# Altium schematic sheet [03] - MICROCONTROLLER.SchDoc
size A3; Collaborator: Romy Bompart
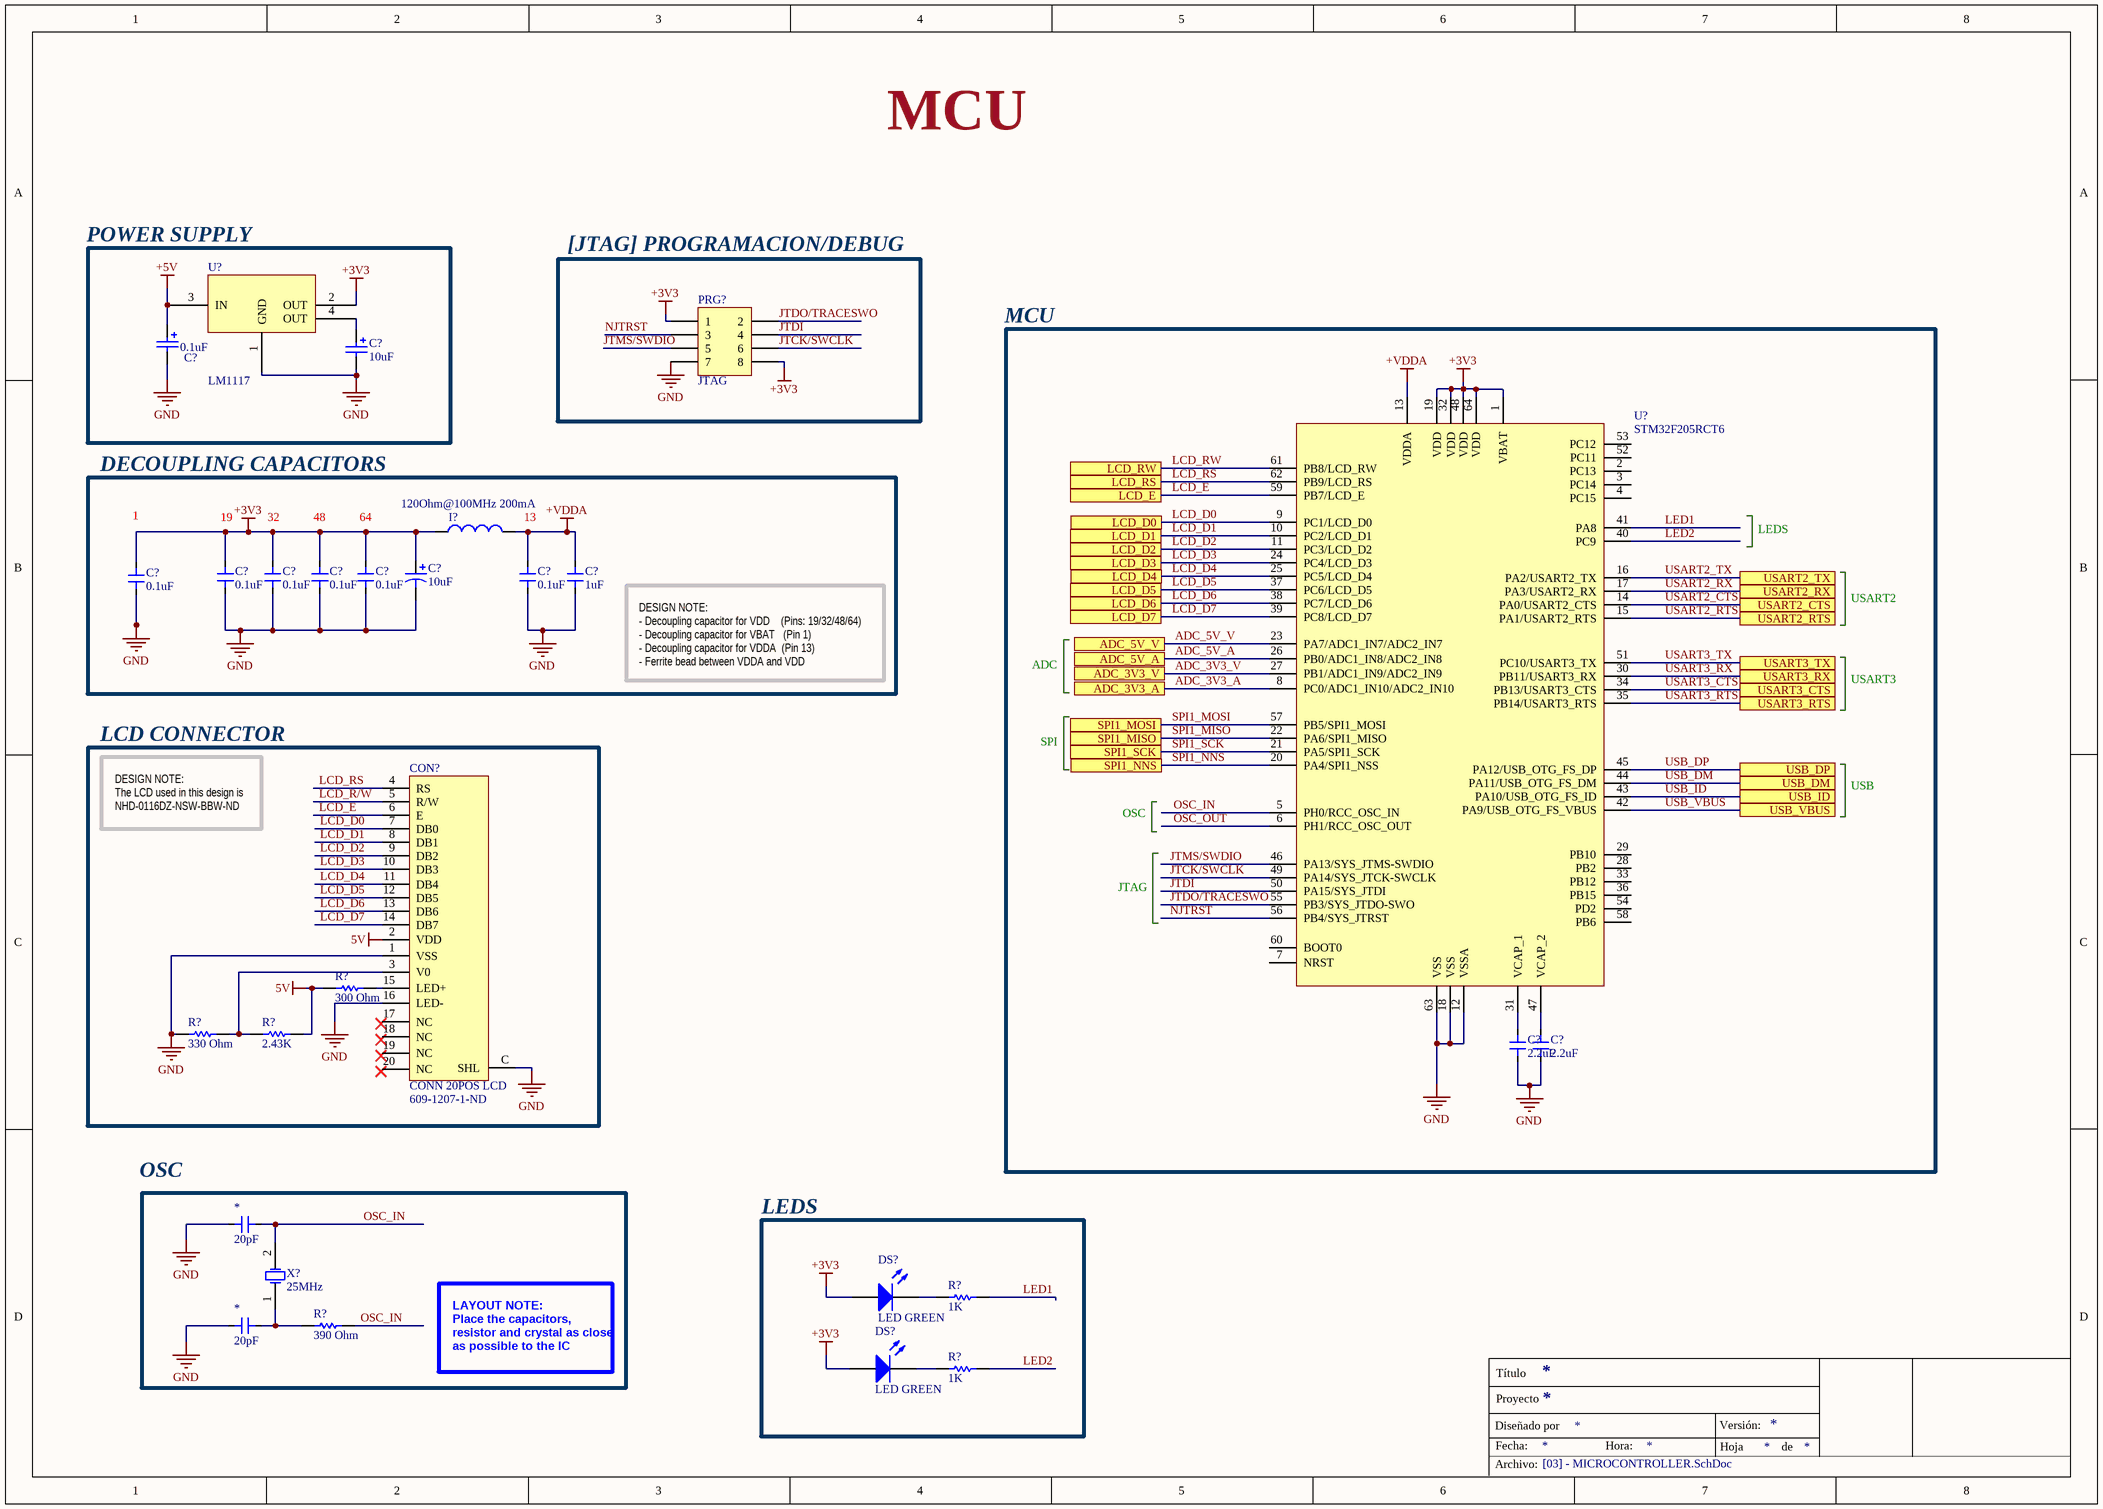
[diagram p0: [03] - MICROCONTROLLER.SchDoc]

## Parts
(Parts that share a designator on the sheet are numbered #1, #2 ... from top to bottom, then left to right.)
*#1  20pF  [CC-0603]
*#2  20pF  [CC-0603]
C?#1  value 0.1uF  [CC-0603]  (hidden comment: 1276-1000-1-ND)
C?#2  10uF  [CC-0805]
C?#3  10uF
C?#4  1uF
C?#5  0.1uF  [CC-0603]
C?#6  0.1uF  [CC-0603]
C?#7  0.1uF  [CC-0603]
C?#8  0.1uF  [CC-0603]
C?#9  0.1uF  [CC-0603]
C?#10  0.1uF  [CC-0603]
C?#11  2.2uF
C?#12  2.2uF
CON?  CONN 20POS LCD  Supplier Part Number 1: 609-1207-1-ND
DS?#1  LED GREEN
DS?#2  LED GREEN
I?  120Ohm@100MHz 200mA
PRG?  JTAG
R?#1  300 Ohm
R?#2  330 Ohm
R?#3  2.43K
R?#4  1K
R?#5  390 Ohm
R?#6  1K
U?#1  LM1117
U?#2  STM32F205RCT6
X?  25MHz

## Blocks framed on the sheet
POWER SUPPLY: C?#1 C?#2 U?#1
[JTAG] PROGRAMACION/DEBUG: PRG?
MCU: C?#11 C?#12 U?#2
DECOUPLING CAPACITORS: C?#3-C?#10 I?
LCD CONNECTOR: CON? R?#1-R?#3
OSC: *#1 *#2 R?#5 X?
LEDS: DS?#1 DS?#2 R?#4 R?#6

## Ports
ADC_3V3_A, ADC_3V3_V, ADC_5V_A, ADC_5V_V, LCD_D0, LCD_D1, LCD_D2, LCD_D3, LCD_D4, LCD_D5, LCD_D6, LCD_D7, LCD_E, LCD_RS, LCD_RW, SPI1_MISO, SPI1_MOSI, SPI1_NNS, SPI1_SCK, USART2_CTS, USART2_RTS, USART2_RX, USART2_TX, USART3_CTS, USART3_RTS, USART3_RX, USART3_TX, USB_DM, USB_DP, USB_ID, USB_VBUS

## Nets
5V: CON?.2(VDD) R?#1.1 R?#3.2
+3V3: C?#3.1 C?#5.1 C?#6.1 C?#7.1 C?#8.1 C?#9.1 DS?#1.2(A) DS?#2.2(A) I?.1 PRG?.1 PRG?.8 U?#1.2(OUT) U?#2.1(VBAT) U?#2.19(VDD) U?#2.32(VDD) U?#2.48(VDD) U?#2.64(VDD)
+5V: C?#1.1 U?#1.3(IN)
+VDDA: C?#4.2 C?#10.1 I?.2 U?#2.13(VDDA)
GND: *#1.2 *#2.2 C?#1.2 C?#2.2 C?#3.2 C?#4.1 C?#5.2 C?#6.2 C?#7.2 C?#8.2 C?#9.2 C?#10.2 C?#11.1 C?#12.2 CON?.1(VSS) CON?.16(LED-) CON?.C(SHL) PRG?.7 R?#2.1 U?#1.1(GND) U?#2.12(VSSA) U?#2.18(VSS) U?#2.63(VSS)
ADC_3V3_A: U?#2.8(PC0/ADC1_IN10/ADC2_IN10) ; port ADC_3V3_A
ADC_3V3_V: U?#2.27(PB1/ADC1_IN9/ADC2_IN9) ; port ADC_3V3_V
ADC_5V_A: U?#2.26(PB0/ADC1_IN8/ADC2_IN8) ; port ADC_5V_A
ADC_5V_V: U?#2.23(PA7/ADC1_IN7/ADC2_IN7) ; port ADC_5V_V
JTCK/SWCLK: PRG?.6 U?#2.49(PA14/SYS_JTCK-SWCLK)
JTDI: PRG?.4 U?#2.50(PA15/SYS_JTDI)
JTDO/TRACESWO: PRG?.2 U?#2.55(PB3/SYS_JTDO-SWO)
JTMS/SWDIO: PRG?.5 U?#2.46(PA13/SYS_JTMS-SWDIO)
LCD_D0: CON?.7(DB0) U?#2.9(PC1/LCD_D0) ; port LCD_D0
LCD_D1: CON?.8(DB1) U?#2.10(PC2/LCD_D1) ; port LCD_D1
LCD_D2: CON?.9(DB2) U?#2.11(PC3/LCD_D2) ; port LCD_D2
LCD_D3: CON?.10(DB3) U?#2.24(PC4/LCD_D3) ; port LCD_D3
LCD_D4: CON?.11(DB4) U?#2.25(PC5/LCD_D4) ; port LCD_D4
LCD_D5: CON?.12(DB5) U?#2.37(PC6/LCD_D5) ; port LCD_D5
LCD_D6: CON?.13(DB6) U?#2.38(PC7/LCD_D6) ; port LCD_D6
LCD_D7: CON?.14(DB7) U?#2.39(PC8/LCD_D7) ; port LCD_D7
LCD_E: CON?.6(E) U?#2.59(PB7/LCD_E) ; port LCD_E
LCD_R/W: CON?.5(R/W)
LCD_RS: CON?.4(RS) U?#2.62(PB9/LCD_RS) ; port LCD_RS
LCD_RW: U?#2.61(PB8/LCD_RW) ; port LCD_RW
LED1: R?#4.2 U?#2.41(PA8)
LED2: R?#6.2 U?#2.40(PC9)
NJTRST: PRG?.3 U?#2.56(PB4/SYS_JTRST)
OSC_IN: *#1.1 R?#5.2 U?#2.5(PH0/RCC_OSC_IN) X?.2(OSC2)
OSC_OUT: U?#2.6(PH1/RCC_OSC_OUT)
SPI1_MISO: U?#2.22(PA6/SPI1_MISO) ; port SPI1_MISO
SPI1_MOSI: U?#2.57(PB5/SPI1_MOSI) ; port SPI1_MOSI
SPI1_NNS: U?#2.20(PA4/SPI1_NSS) ; port SPI1_NNS
SPI1_SCK: U?#2.21(PA5/SPI1_SCK) ; port SPI1_SCK
USART2_CTS: U?#2.14(PA0/USART2_CTS) ; port USART2_CTS
USART2_RTS: U?#2.15(PA1/USART2_RTS) ; port USART2_RTS
USART2_RX: U?#2.17(PA3/USART2_RX) ; port USART2_RX
USART2_TX: U?#2.16(PA2/USART2_TX) ; port USART2_TX
USART3_CTS: U?#2.34(PB13/USART3_CTS) ; port USART3_CTS
USART3_RTS: U?#2.35(PB14/USART3_RTS) ; port USART3_RTS
USART3_RX: U?#2.30(PB11/USART3_RX) ; port USART3_RX
USART3_TX: U?#2.51(PC10/USART3_TX) ; port USART3_TX
USB_DM: U?#2.44(PA11/USB_OTG_FS_DM) ; port USB_DM
USB_DP: U?#2.45(PA12/USB_OTG_FS_DP) ; port USB_DP
USB_ID: U?#2.43(PA10/USB_OTG_FS_ID) ; port USB_ID
USB_VBUS: U?#2.42(PA9/USB_OTG_FS_VBUS) ; port USB_VBUS
Net*#2_1: *#2.1 R?#5.1 X?.1(OSC1)
NetC?#2_1: C?#2.1 U?#1.4(OUT)
NetC?#11_2: C?#11.2 U?#2.47(VCAP_2)
NetC?#12_1: C?#12.1 U?#2.31(VCAP_1)
NetCON?_3: CON?.3(V0) R?#2.2 R?#3.1
NetCON?_15: CON?.15(LED+) R?#1.2
NetDS?#1_1: DS?#1.1(K) R?#4.1
NetDS?#2_1: DS?#2.1(K) R?#6.1

Not connected (* = marked no-connect by the designer): CON? 17(NC) 18(NC) 19(NC) 20(NC); U?#2 2(PC13) 3(PC14) 4(PC15) 7(NRST) 28(PB2) 29(PB10) 33(PB12) 36(PB15) 52(PC11) 53(PC12) 54(PD2) 58(PB6) 60(BOOT0)

## Notes on the sheet
- MCU
- (near C?#5) 1
- (near C?#6) 19
- (near C?#7) 32
- (near C?#8) 48
- (near C?#9) 64
- (near I?) 13
- LEDS
- USART2
- DESIGN NOTE:
  - Decoupling capacitor for VDD    (Pins: 19/32/48/64)
  - Decoupling capacitor for VBAT   (Pin 1)
  - Decoupling capacitor for VDDA  (Pin 13)
  - Ferrite bead between VDDA and VDD
- ADC
- USART3
- SPI
- USB
- DESIGN NOTE:
  The LCD used in this design is NHD-0116DZ-NSW-BBW-ND
- OSC
- JTAG
- LAYOUT NOTE:
  Place the capacitors, resistor and crystal as close as possible to the IC
- Título
- Diseñado por
- Fecha:
- Proyecto
- Hora:
- Versión:
- Hoja
- de
- Archivo:

## Library data of the parts
*#1 *#2 = CC0603JRNPO9BN200: CAP CER 20PF 50V C0G/NPO 0603; Manufacturer: Yageo; Tolerance: 5%; Dielectric: C0G; Supplier 1: Digi-Key; Manufacturer Part Number: CC0603JRNPO9BN200; Stock 1: 223075; Pricing 1: 1=0.1, 10=0.048, 100=0.0214, 500=0.0153, 1000=0.012 (USD); Mount: Surface Mount; Case/Package: 0603; Number of Pins: 2; Weight: 7.1E-05oz; Case Code (Imperial): 0603; Case Code (Metric): 1608; Min Operating Temperature: -55°C; Max Operating Temperature: 125°C; Capacitance: 20pF; Package Quantity: 4000; Voltage Rating (DC): 50V; Packaging: Tape and Reel; Voltage Rating: 50V; Termination: SMD/SMT; Composition: Ceramic; Length: 1.6mm; Width: 0.8mm; Thickness: 0.035inch; Depth: 0.8mm; REACH SVHC: Unknown; Lead Free: Lead Free; ComponentLink1URL: http://www.farnell.com/datasheets/1132289.pdf?src-supplier=Element14; ComponentLink1Description: http://www.farnell.com/datasheets/1132289.pdf?src-supplier=Element14; ComponentLink2URL: http://www.yageo.com/documents/recent/UPY-GP_NP0_16V-to-50V_16.pdf?src-supplier=Digi-Key; ComponentLink2Description: http://www.yageo.com/documents/recent/UPY-GP_NP0_16V-to-50V_16.pdf?src-supplier=Digi-Key; Supplier Part Number 1: 311-1424-6-ND
C?#1 = Cap Pol1: CAP CER 0.1UF 50V X7R 0603; Supplier 1: Digi-Key; Supplier Part Number 1: 1276-1000-1-ND
C?#2 = Cap Pol1: CAP TANT 10UF 20% 6.3V 0805; Value: 10uF; Supplier 1: Digi-Key; Supplier Part Number 1: 511-1447-1-ND
C?#3 = TCP0J106M8R: CAP TANT 10UF 6.3V 20% 0805; Manufacturer: Rohm; ESR (Equivalent Series Resistance): 8.3R; Supplier 1: Digi-Key; Manufacturer Part Number: TCP0J106M8R; Stock 1: 89891; Pricing 1: 1=0.46, 10=0.316, 100=0.1898, 500=0.1423, 1000=0.1202 (USD); Mount: Surface Mount; Case/Package: 0805; Case Code (Metric): 2012; Case Code (Imperial): 0805; Min Operating Temperature: -55°C; Max Operating Temperature: 125°C; Capacitance: 10uF; Tolerance: 20%; Package Quantity: 1; Voltage Rating: 6.3V; Packaging: Tape and Reel; Voltage Rating (DC): 6.3V; Features: General Purpose; Length: 0.079inch; Width: 0.049inch; Height - Seated (Max): 0.047inch; Lead Free: Lead Free; ComponentLink1URL: http://rohmfs.rohm.com/en/products/databook/datasheet/passive/tantalum_capacitor/tantalum_chip_capacitor/tc_p.pdf?src-supplier=Future+Electronics; ComponentLink1Description: http://rohmfs.rohm.com/en/products/databook/datasheet/passive/tantalum_capacitor/tantalum_chip_capacitor/tc_p.pdf?src-supplier=Future+Electronics; Supplier Part Number 1: 511-1447-6-ND
C?#4 = C1608X5R1H105K080AB: CAP CER 1uF 50V X5R 0603; Manufacturer: TDK; Dielectric Material: Ceramic; Tolerance: 10%; Supplier 1: Digi-Key; Manufacturer Part Number: C1608X5R1H105K080AB; Stock 1: 233012; Pricing 1: 1=0.25, 10=0.171, 100=0.0865, 500=0.0592, 1000=0.0524 (USD); Mount: Surface Mount; Case/Package: 0603; Number of Pins: 2; Weight: 7.1E-05oz; Case Code (Metric): 1608; Case Code (Imperial): 0603; Min Operating Temperature: -55°C; Max Operating Temperature: 85°C; Capacitance: 1uF; Packaging: Tape and Reel; Voltage Rating: 50V; Package Quantity: 1; Voltage Rating (DC): 50V; Dielectric: X5R; Termination: SMD/SMT; Voltage: 50V; Composition: Ceramic; Length: 1.6mm; Height: 0.8mm; Width: 0.031inch; Thickness: 0.035inch; Depth: 0.8mm; Radiation Hardening: No; REACH SVHC: No SVHC; Lead Free: Lead Free; ComponentLink1URL: http://www.tdk.co.jp/tefe02/e412_c.pdf?src-supplier=Avnet+Europe; ComponentLink1Description: http://www.tdk.co.jp/tefe02/e412_c.pdf?src-supplier=Avnet+Europe; ComponentLink2URL: https://product.tdk.com/info/en/catalog/spec/mlccspec_commercial_general_midvoltage_en.pdf?src-supplier=Digi-Key; ComponentLink2Description: https://product.tdk.com/info/en/catalog/spec/mlccspec_commercial_general_midvoltage_en.pdf?src-supplier=Digi-Key; ComponentLink3URL: http://www.farnell.com/datasheets/1913358.pdf?src-supplier=Element14; ComponentLink3Description: http://www.farnell.com/datasheets/1913358.pdf?src-supplier=Element14; Supplier Part Number 1: 445-7468-6-ND
C?#5-C?#10 = CGA3E2X7R1H104K080AA: CAP CER 0.1uF 50V X7R 0603; Manufacturer: TDK; Capacitance: 100nF; Tolerance: 10%; Supplier 1: Digi-Key; Manufacturer Part Number: CGA3E2X7R1H104K080AA; Stock 1: 11580568; Pricing 1: 1=0.1, 10=0.075, 100=0.0335, 500=0.0239, 1000=0.0188 (USD); Mount: Surface Mount; Case/Package: 0603; Weight: 7.1E-05oz; Case Code (Imperial): 0603; Case Code (Metric): 1608; Min Operating Temperature: -55°C; Max Operating Temperature: 125°C; Packaging: Tape and Reel; Package Quantity: 1; Voltage Rating: 50V; Dielectric: X7R; Voltage Rating (DC): 50V; Termination: SMD/SMT; Voltage: 50V; Composition: Ceramic; Length: 1.6mm; Height: 0.8mm; Width: 0.8mm; Thickness: 0.035inch; Depth: 0.8mm; Ratings: AEC-Q200; Radiation Hardening: No; REACH SVHC: No SVHC; Lead Free: Lead Free; ComponentLink1URL: http://www.farnell.com/datasheets/1796654.pdf?src-supplier=Mouser; ComponentLink1Description: http://www.farnell.com/datasheets/1796654.pdf?src-supplier=Mouser; ComponentLink2URL: http://product.tdk.com/capacitor/mlcc/en/documents/mlccspec_automotive_general_midvoltage_en.pdf?src-supplier=Future+Electronics; ComponentLink2Description: http://product.tdk.com/capacitor/mlcc/en/documents/mlccspec_automotive_general_midvoltage_en.pdf?src-supplier=Future+Electronics; ComponentLink3URL: http://www.farnell.com/datasheets/1735392.pdf?src-supplier=Element14; ComponentLink3Description: http://www.farnell.com/datasheets/1735392.pdf?src-supplier=Element14; ComponentLink4URL: https://www.verical.com/server-webapp/html/getDatasheet?partID=715867&src-supplier=Verical; ComponentLink4Description: https://www.verical.com/server-webapp/html/getDatasheet?partID=715867&src-supplier=Verical; ComponentLink5URL: http://www.farnell.com/datasheets/1796654.pdf?src-supplier=Newark; ComponentLink5Description: http://www.farnell.com/datasheets/1796654.pdf?src-supplier=Newark; Supplier Part Number 1: 445-5666-6-ND
C?#11 C?#12 = C0603C225K4PACTU: KEMET - C0603C225K4PACTU - CAP, MLCC, X5R, 2.2UF, 16V, 0603; Dielectric Material: Ceramic; Tolerance: 10%; Dissipation Factor: 5%; Supplier 1: Digi-Key; Manufacturer: KEMET; Manufacturer Part Number: C0603C225K4PACTU; Stock 1: 49901; Pricing 1: 1=0.16, 10=0.112, 100=0.0528, 500=0.037, 1000=0.0307 (USD); Mount: Surface Mount; Case/Package: 0603; Number of Pins: 2; Case Code (Imperial): 0603; Case Code (Metric): 1608; Contact Plating: Tin,Matte; Min Operating Temperature: -55°C; Max Operating Temperature: 85°C; Capacitance: 2.2uF; Voltage Rating: 16V; Voltage Rating (DC): 16V; Packaging: Tape and Reel; Package Quantity: 1; Dielectric: X5R; Termination: SMD/SMT; Voltage: 16V; Length: 1.6mm; Height: 0.8mm; Width: 0.8mm; Thickness: 0.034inch; Depth: 0.8mm; Radiation Hardening: No; REACH SVHC: No SVHC; Lead Free: Lead Free; ComponentLink1URL: http://www.farnell.com/datasheets/2739684.pdf?src-supplier=Farnell; ComponentLink1Description: http://www.farnell.com/datasheets/2739684.pdf?src-supplier=Farnell; ComponentLink2URL: http://www.farnell.com/datasheets/2123797.pdf?src-supplier=Element14; ComponentLink2Description: http://www.farnell.com/datasheets/2123797.pdf?src-supplier=Element14; Supplier Part Number 1: 399-7886-1-ND
CON? = 62674-201121ALF: CONN FFC VERT 20POS 0.50MM SMD; Manufacturer: Amphenol FCI; Actuator Material: Plastic,Glass; Contact Resistance: 30mR; Voltage Rating: 50V; Current Rating: 500mA; Gender: Receptacle; Number of Positions: 20; Insulation Resistance: 100MR; Wire/Cable Type: Straight; Pitch: 1mm; Supplier 1: Digi-Key; Manufacturer Part Number: 62674-201121ALF; Stock 1: 37230; Pricing 1: 1=0.74, 10=0.65, 25=0.6124, 50=0.5868, 100=0.5612, 250=0.5102, 500=0.4592 (USD); Mount: Surface Mount; Contact Material: Bronze; Contact Plating: Gold; Housing Color: Black; Housing Material: Resin; Min Operating Temperature: -55°C; Max Operating Temperature: 85°C; Number of Rows: 1; Packaging: Tape and Reel; Package Quantity: 1000; Termination: Solder; Max Voltage Rating (AC): 50V; Max Voltage Rating (DC): 50V; Number of Contacts: 20; Orientation: Straight; Length: 14.5mm; Depth: 2.95mm; Width: 2.95mm; Radiation Hardening: No; REACH SVHC: No SVHC; Lead Free: Lead Free; Flammability Rating: UL94 V-0; ComponentLink1URL: http://www.mouser.com/ds/2/154/62674-26092.pdf?src-supplier=Mouser; ComponentLink1Description: http://www.mouser.com/ds/2/154/62674-26092.pdf?src-supplier=Mouser; ComponentLink2URL: http://portal.fciconnect.com/Comergent//fci/drawing/62674.pdf?src-supplier=Digi-Key; ComponentLink2Description: http://portal.fciconnect.com/Comergent//fci/drawing/62674.pdf?src-supplier=Digi-Key; ComponentLink3URL: https://cdn.amphenol-icc.com/media/wysiwyg/files/drawing/62674.pdf?src-supplier=Digi-Key; ComponentLink3Description: https://cdn.amphenol-icc.com/media/wysiwyg/files/drawing/62674.pdf?src-supplier=Digi-Key; ComponentLink4URL: http://portal.fciconnect.com/Comergent/fci/drawing/62674.pdf?src-supplier=Avnet; ComponentLink4Description: http://portal.fciconnect.com/Comergent/fci/drawing/62674.pdf?src-supplier=Avnet; ComponentLink5URL: http://portal.fciconnect.com/Comergent/fci/drawing/62674.pdf?src-supplier=Avnet+Asia; ComponentLink5Description: http://portal.fciconnect.com/Comergent/fci/drawing/62674.pdf?src-supplier=Avnet+Asia
DS?#1 DS?#2 = LGR971-KN-1: LED Uni-Color Green 572nm 2-Pin SMD T/R; Manufacturer: Osram Opto; Lens Color: White; Forward Current: 25mA; Forward Voltage: 2.2V; Lens Style: Diffused,Flat,Colorless,Rectangular; Luminous Intensity: 45mcd; Viewing Angle: 160°; Test Current: 20mA; Dominant Wavelength: 570nm; Lens Transparency: Diffused; Luminous Flux: 0.1lm; Number of Elements: 1; Power Dissipation: 65mW; Reverse Voltage: 12V; Lens Size: 1.25mm; Supplier 1: Digi-Key; Manufacturer Part Number: LGR971-KN-1; Stock 1: 173237; Pricing 1: 1=0.31, 10=0.229, 100=0.1083, 500=0.0722, 1000=0.0566 (USD); Mount: Surface Mount; Case/Package: 0805; Number of Pins: 2; Color: Green; Case Code (Metric): 2012; Case Code (Imperial): 0805; Min Operating Temperature: -30°C; Max Operating Temperature: 85°C; Packaging: Tape and Reel; Package Quantity: 1; Illumination Color: Green; Number of LEDs: 1; Length: 2.1mm; Height: 0.9mm; Width: 1.25mm; Depth: 1.35mm; Radiation Hardening: No; ComponentLink1URL: https://www.verical.com/server-webapp/html/getDatasheet?partID=233880&src-supplier=Verical; ComponentLink1Description: https://www.verical.com/server-webapp/html/getDatasheet?partID=233880&src-supplier=Verical; ComponentLink2URL: https://www.verical.com/server-webapp/html/getDatasheet?partID=462214&src-supplier=Verical; ComponentLink2Description: https://www.verical.com/server-webapp/html/getDatasheet?partID=462214&src-supplier=Verical; ComponentLink3URL: https://dammedia.osram.info/media/resource/hires/osram-dam-2493936/LG%20R971.pdf?src-supplier=Digi-Key; ComponentLink3Description: https://dammedia.osram.info/media/resource/hires/osram-dam-2493936/LG%20R971.pdf?src-supplier=Digi-Key; ComponentLink4URL: http://www.mouser.com/ds/2/311/LG%20R971%20-%20CHIPLED%200805-318376.pdf?src-supplier=Mouser; ComponentLink4Description: http://www.mouser.com/ds/2/311/LG%20R971%20-%20CHIPLED%200805-318376.pdf?src-supplier=Mouser; Supplier Part Number 1: 475-1410-6-ND
I? = BLM21AG121SN1D: FERRITE BEAD 120 OHM 0805 1LN; Manufacturer: Murata; Resistance: 150mR; Impedance: 120R; Tolerance: 25%; Current Rating: 800mA; Max Current Rating: 1A; DC Resistance (DCR): 100mR; Test Frequency: 100MHz; Number of Lines: 1; Shielding: Unshielded; Supplier 1: Digi-Key; Manufacturer Part Number: BLM21AG121SN1D; Stock 1: 40999; Pricing 1: 1=0.15, 10=0.119, 25=0.0924, 50=0.0766, 100=0.066, 250=0.0528, 500=0.0475, 1000=0.0396 (USD); Case/Package: 0805; Number of Pins: 2; Core Material: Ferrite; Case Code (Metric): 2012; Case Code (Imperial): 0805; Material: Steel,Ferrite; Min Operating Temperature: -55°C; Max Operating Temperature: 125°C; Package Quantity: 1; Packaging: Tape and Reel; Max DC Current: 200mA; Termination: SMD/SMT; DC Current: 200mA; Military Standard: Not; Frequency: 100MHz; Number of Circuits: 1; Length: 2mm; Height: 0.85mm; Width: 1.25mm; Depth: 1.25mm; Radiation Hardening: No; REACH SVHC: No SVHC; Lead Free: Lead Free; ComponentLink1URL: http://www.farnell.com/datasheets/1914683.pdf?src-supplier=Farnell; ComponentLink1Description: http://www.farnell.com/datasheets/1914683.pdf?src-supplier=Farnell; ComponentLink2URL: http://search.murata.co.jp/Ceramy/image/img/PDF/ENG/L0110S0100BLM21A.pdf?src-supplier=Future+Electronics; ComponentLink2Description: http://search.murata.co.jp/Ceramy/image/img/PDF/ENG/L0110S0100BLM21A.pdf?src-supplier=Future+Electronics; ComponentLink3URL: https://www.murata.com/en-us/products/productdata/8796738977822/ENFA0005.pdf?src-supplier=Avnet; ComponentLink3Description: https://www.murata.com/en-us/products/productdata/8796738977822/ENFA0005.pdf?src-supplier=Avnet; ComponentLink4URL: https://www.murata.com/en-us/products/productdata/8796738977822/ENFA0005.pdf?src-supplier=Avnet+Europe; ComponentLink4Description: https://www.murata.com/en-us/products/productdata/8796738977822/ENFA0005.pdf?src-supplier=Avnet+Europe; ComponentLink5URL: https://www.murata.com/en-us/products/productdata/8796738977822/ENFA0005.pdf?src-supplier=Digi-Key; ComponentLink5Description: https://www.murata.com/en-us/products/productdata/8796738977822/ENFA0005.pdf?src-supplier=Digi-Key; ComponentLink6URL: http://www.produktinfo.conrad.com/datenblaetter/1100000-1199999/001172324-da-01-en-DROSSEL_0805_120R_2_0X1_25MM_4000ST.pdf?src-supplier=Conrad; ComponentLink6Description: http://www.produktinfo.conrad.com/datenblaetter/1100000-1199999/001172324-da-01-en-DROSSEL_0805_120R_2_0X1_25MM_4000ST.pdf?src-supplier=Conrad; ComponentLink7URL: http://www.produktinfo.conrad.com/datenblaetter/425000-449999/442447-da-01-en-CHIP_DROSSEL_0805_120R_200MA_2_0X1_25MM.pdf?src-supplier=Conrad; ComponentLink7Description: http://www.produktinfo.conrad.com/datenblaetter/425000-449999/442447-da-01-en-CHIP_DROSSEL_0805_120R_200MA_2_0X1_25MM.pdf?src-supplier=Conrad; Supplier Part Number 1: 490-1038-1-ND
PRG? = 20021311-00008T4LF: CONN RCPT 8POS 0.05 GOLD PCB; Manufacturer: Amphenol FCI; Contact Resistance: 30mR; Current Rating: 1A; Voltage Rating: 125V; Connector Type: Receptacle,Socket; Number of Positions: 8; Gender: Female; Pitch: 1.27mm; Row Spacing: 0.05inch; Stack Height: 4.3mm; Supplier 1: Digi-Key; Manufacturer Part Number: 20021311-00008T4LF; Stock 1: 15145; Pricing 1: 1=0.76, 10=0.711, 106=0.5449, 530=0.4738, 1060=0.3909, 5088=0.3435, 10070=0.3198 (USD); Mount: Through Hole; Contact Plating: Gold; Contact Material: Copper Alloy; Color: Black; Housing Material: Plastic; Min Operating Temperature: -40°C; Max Operating Temperature: 85°C; Package Quantity: 106; Number of Rows: 2; Packaging: Rail/Tube; Termination: Solder; Max Voltage Rating (AC): 125V; Number of Contacts: 8; Orientation: Straight; Length: 3.81mm; Depth: 3mm; Radiation Hardening: No; ComponentLink1URL: https://media.digikey.com/pdf/Data%20Sheets/FCI%20PDFs/Minitek%20127_Catalog.pdf?src-supplier=Digi-Key; ComponentLink1Description: https://media.digikey.com/pdf/Data%20Sheets/FCI%20PDFs/Minitek%20127_Catalog.pdf?src-supplier=Digi-Key; ComponentLink2URL: http://portal.fciconnect.com/Comergent/fci/drawing/20021311.pdf?src-supplier=Avnet; ComponentLink2Description: http://portal.fciconnect.com/Comergent/fci/drawing/20021311.pdf?src-supplier=Avnet; ComponentLink3URL: http://portal.fciconnect.com/Comergent/fci/drawing/20021311.pdf?src-supplier=Avnet+Europe; ComponentLink3Description: http://portal.fciconnect.com/Comergent/fci/drawing/20021311.pdf?src-supplier=Avnet+Europe; ComponentLink4URL: http://portal.fciconnect.com/Comergent//fci/drawing/20021311.pdf?src-supplier=Mouser; ComponentLink4Description: http://portal.fciconnect.com/Comergent//fci/drawing/20021311.pdf?src-supplier=Mouser; Supplier Part Number 1: 609-3753-ND
R?#1 = RC0603JR-07300RL: RES SMD 300 OHM 5% 1/10W 0603; Manufacturer: Yageo; Resistance: 300R; Power Rating: 100mW; Voltage Rating: 75V; Temperature Coefficient: 100ppm/°C; Voltage Rating (DC): 50V; Supplier 1: Digi-Key; Manufacturer Part Number: RC0603JR-07300RL; Stock 1: 150; Pricing 1: 1=0.1, 10=0.02, 100=0.0081, 1000=0.0036, 2500=0.0031 (USD); Case/Package: 0603; Number of Pins: 2; Weight: 7.1E-05oz; Case Code (Imperial): 0603; Case Code (Metric): 1608; Min Operating Temperature: -55°C; Max Operating Temperature: 155°C; Tolerance: 5%; Packaging: Tape and Reel; Termination: SMD/SMT; Composition: Thick Film; Military Standard: Not; Length: 1.6mm; Height: 0.45mm; Width: 0.8mm; Depth: 0.8mm; REACH SVHC: Unknown; Lead Free: Lead Free; ComponentLink1URL: http://www.farnell.com/datasheets/2167052.pdf?src-supplier=Farnell; ComponentLink1Description: http://www.farnell.com/datasheets/2167052.pdf?src-supplier=Farnell; ComponentLink2URL: http://www.yageo.com/documents/recent/PYu-RC0603_51_RoHS_L_7.pdf?src-supplier=Future+Electronics; ComponentLink2Description: http://www.yageo.com/documents/recent/PYu-RC0603_51_RoHS_L_7.pdf?src-supplier=Future+Electronics; ComponentLink3URL: http://www.mouser.com/ds/2/447/RC0603-1212058.pdf?src-supplier=Mouser; ComponentLink3Description: http://www.mouser.com/ds/2/447/RC0603-1212058.pdf?src-supplier=Mouser; ComponentLink4URL: http://components.arrow.com/part/dataview/0323_03543424?src-supplier=Arrow+Europe; ComponentLink4Description: http://components.arrow.com/part/dataview/0323_03543424?src-supplier=Arrow+Europe; ComponentLink5URL: http://www.yageo.com/documents/recent/PYu-RC_Group_51_RoHS_L_9.pdf?src-supplier=Digi-Key; ComponentLink5Description: http://www.yageo.com/documents/recent/PYu-RC_Group_51_RoHS_L_9.pdf?src-supplier=Digi-Key; ComponentLink6URL: http://www.yageo.com/documents/recent/PYu-RC_Group_51_RoHS_L_10.pdf?src-supplier=Digi-Key; ComponentLink6Description: http://www.yageo.com/documents/recent/PYu-RC_Group_51_RoHS_L_10.pdf?src-supplier=Digi-Key; ComponentLink7URL: http://www.farnell.com/datasheets/1868787.pdf?src-supplier=Element14; ComponentLink7Description: http://www.farnell.com/datasheets/1868787.pdf?src-supplier=Element14; Supplier Part Number 1: 311-300GRDKR-ND
R?#2 = RC0603JR-07330RL: RES SMD 330 OHM 5% 1/10W 0603; Manufacturer: Yageo; Resistance: 330R; Power Rating: 100mW; Voltage Rating (DC): 50V; Temperature Coefficient: 100ppm/°C; Supplier 1: Digi-Key; Manufacturer Part Number: RC0603JR-07330RL; Stock 1: 5319563; Pricing 1: 1=0.1, 10=0.02, 100=0.0081, 1000=0.0036, 2500=0.0031 (USD); Case/Package: 0603; Number of Pins: 2; Case Code (Imperial): 0603; Case Code (Metric): 1608; Min Operating Temperature: -55°C; Max Operating Temperature: 155°C; Tolerance: 5%; Packaging: Tape and Reel; Voltage Rating: 50V; Package Quantity: 5000; Termination: SMD/SMT; Composition: Thick Film; Military Standard: Not; Length: 1.6mm; Height: 0.45mm; Width: 0.8mm; Depth: 0.8mm; REACH SVHC: No SVHC; Lead Free: Lead Free; ComponentLink1URL: http://www.farnell.com/datasheets/1868787.pdf?src-supplier=Element14; ComponentLink1Description: http://www.farnell.com/datasheets/1868787.pdf?src-supplier=Element14; ComponentLink2URL: http://www.farnell.com/datasheets/443971.pdf?src-supplier=Element14; ComponentLink2Description: http://www.farnell.com/datasheets/443971.pdf?src-supplier=Element14; ComponentLink3URL: https://www.verical.com/server-webapp/html/getDatasheet?partID=342831&src-supplier=Verical; ComponentLink3Description: https://www.verical.com/server-webapp/html/getDatasheet?partID=342831&src-supplier=Verical; ComponentLink4URL: http://www.mouser.com/catalog/specsheets/RC0603.pdf?src-supplier=Mouser; ComponentLink4Description: http://www.mouser.com/catalog/specsheets/RC0603.pdf?src-supplier=Mouser; Supplier Part Number 1: 311-330GRDKR-ND
R?#3 = RC0603FR-072K43L: RES SMD 2.43K OHM 1% 1/10W 0603; Manufacturer: Yageo; Resistance: 2.43kR; Power Rating: 100mW; Voltage Rating: 50V; Temperature Coefficient: 100ppm/°C; Supplier 1: Digi-Key; Manufacturer Part Number: RC0603FR-072K43L; Stock 1: 703719; Pricing 1: 1=0.1, 10=0.024, 100=0.0097, 1000=0.0044, 2500=0.0038 (USD); Case/Package: 0603; Case Code (Metric): 1608; Case Code (Imperial): 0603; Min Operating Temperature: -55°C; Max Operating Temperature: 155°C; Tolerance: 1%; Packaging: Tape and Reel; Composition: Thick Film; Termination: SMD/SMT; Military Standard: Not; Voltage Rating (DC): 50V; Package Quantity: 1; Number of Terminations: 2; Max Power Dissipation: 100mW; Features: Moisture Resistant; Length: 1.6mm; Height: 0.022inch; Width: 0.031inch; Depth: 0.8mm; Lead Free: Lead Free; ComponentLink1URL: https://www.verical.com/server-webapp/html/getDatasheet?partID=28835&src-supplier=Verical; ComponentLink1Description: https://www.verical.com/server-webapp/html/getDatasheet?partID=28835&src-supplier=Verical; ComponentLink2URL: http://www.yageo.com/documents/recent/PYu-RC_Group_51_RoHS_L_9.pdf?src-supplier=Digi-Key; ComponentLink2Description: http://www.yageo.com/documents/recent/PYu-RC_Group_51_RoHS_L_9.pdf?src-supplier=Digi-Key; ComponentLink3URL: http://www.yageo.com/documents/recent/PYu-RC_Group_51_RoHS_L_10.pdf?src-supplier=Digi-Key; ComponentLink3Description: http://www.yageo.com/documents/recent/PYu-RC_Group_51_RoHS_L_10.pdf?src-supplier=Digi-Key; ComponentLink4URL: http://www.mouser.com/catalog/specsheets/RC0603.pdf?src-supplier=Mouser; ComponentLink4Description: http://www.mouser.com/catalog/specsheets/RC0603.pdf?src-supplier=Mouser; Supplier Part Number 1: 311-2.43KHRDKR-ND
R?#4 R?#6 = RC0603FR-071KL: RES SMD 1K OHM 1% 1/10W 0603; Manufacturer: Yageo; Resistance: 1kR; Power Rating: 100mW; Temperature Coefficient: 100ppm/°C; Voltage Rating: 50V; Supplier 1: Digi-Key; Manufacturer Part Number: RC0603FR-071KL; Stock 1: 48702346; Pricing 1: 1=0.1, 10=0.024, 100=0.0097, 1000=0.0044, 2500=0.0038 (USD); Case/Package: 0603; Case Code (Imperial): 0603; Case Code (Metric): 1608; Contact Plating: Tin,Matte; Min Operating Temperature: -55°C; Max Operating Temperature: 155°C; Tolerance: 1%; Packaging: Tape and Reel; Military Standard: Not; Termination: SMD/SMT; Composition: Thick Film; Length: 1.6mm; Height: 0.45mm; Depth: 0.8mm; Radiation Hardening: No; REACH SVHC: No SVHC; Lead Free: Lead Free; ComponentLink1URL: http://documents.rs-components.com/techlib://itc_doclist_GB.htm?stockno=5048928&src-supplier=RSComponents; ComponentLink1Description: http://documents.rs-components.com/techlib://itc_doclist_GB.htm?stockno=5048928&src-supplier=RSComponents; ComponentLink2URL: http://www.yageo.com/documents/recent/PYu-RC0603_51_RoHS_L_4.pdf?src-supplier=Avnet+Europe; ComponentLink2Description: http://www.yageo.com/documents/recent/PYu-RC0603_51_RoHS_L_4.pdf?src-supplier=Avnet+Europe; ComponentLink3URL: http://www.farnell.com/datasheets/2167052.pdf?src-supplier=Element14; ComponentLink3Description: http://www.farnell.com/datasheets/2167052.pdf?src-supplier=Element14; ComponentLink4URL: http://www.farnell.com/datasheets/1868787.pdf?src-supplier=Element14; ComponentLink4Description: http://www.farnell.com/datasheets/1868787.pdf?src-supplier=Element14; ComponentLink5URL: http://www.yageo.com/documents/recent/PYu-RC_Group_51_RoHS_L_2.pdf?src-supplier=Avnet; ComponentLink5Description: http://www.yageo.com/documents/recent/PYu-RC_Group_51_RoHS_L_2.pdf?src-supplier=Avnet; ComponentLink6URL: https://www.verical.com/server-webapp/html/getDatasheet?partID=404327&src-supplier=Verical; ComponentLink6Description: https://www.verical.com/server-webapp/html/getDatasheet?partID=404327&src-supplier=Verical; ComponentLink7URL: http://www.farnell.com/datasheets/443971.pdf?src-supplier=Element14; ComponentLink7Description: http://www.farnell.com/datasheets/443971.pdf?src-supplier=Element14; Supplier Part Number 1: 311-1.00KHRDKR-ND
R?#5 = RMCF0603FT390R: Res Thick Film 0603 390 Ohm 1% 0.1W ±100ppm/°C Molded SMD Paper T/R; Manufacturer: Stackpole Electronics; Resistance: 390R; Max Power Dissipation: 100mW; Supplier 1: Digi-Key; Manufacturer Part Number: RMCF0603FT390R; Stock 1: 0; Pricing 1: 1=0.1, 10=0.017, 100=0.0068, 1000=0.0031, 2500=0.0027 (USD); Mount: Surface Mount; Case/Package: 0603; Case Code (Metric): 1608; Case Code (Imperial): 0603; Contact Plating: Tin,Matte; Min Operating Temperature: -55°C; Max Operating Temperature: 155°C; Packaging: Tape and Reel; Tolerance: 1%; Composition: Thick Film; Number of Terminations: 2; Temperature Coefficient: 100ppm/°C; Features: Automotive AEC-Q200; Length: 0.061inch; Height: 0.022inch; Width: 0.031inch; Radiation Hardening: No; Supplier Part Number 1: RMCF0603FT390RDKR-ND
U?#1 = LM1117MP-3.3/NOPB: Space saving 800-mA low-dropout linear regulator with internal current limit 4-SOT-223 0 to 125; Manufacturer: TI National Semiconductor; Max Input Voltage: 15V; Dropout Voltage: 1.2V; Output Voltage: 3.3V; Number of Outputs: 1; Max Output Current: 800mA; Polarity: Positive; Quiescent Current: 10mA; Output Voltage Accuracy: 1%; Output Type: Fixed; Supplier 1: Digi-Key; Supplier Part Number 1: LM1117MP-3.3/NOPBDKR-ND; Manufacturer Part Number: LM1117MP-3.3/NOPB; Stock 1: 43034; Pricing 1: 1=1.14, 10=1.015, 100=0.7912, 500=0.6536 (USD); Mount: Surface Mount; Case/Package: SOT-223; Number of Pins: 4; Min Operating Temperature: 0°C; Max Operating Temperature: 125°C; Packaging: Tape and Reel; Output Current: 800mA; Nominal Output Voltage: 3.3V; Accuracy: 1%; Current Rating: 800mA; Package Quantity: 1000; Number of Regulators: 1; Min Current Limit: 800mA; Length: 6.5mm; Height: 1.6mm; Width: 3.56mm; Radiation Hardening: No; REACH SVHC: No SVHC; Lead Free: Lead Free; ComponentLink1URL: https://www.verical.com/server-webapp/html/getDatasheet?partID=112131&src-supplier=Verical; ComponentLink1Description: https://www.verical.com/server-webapp/html/getDatasheet?partID=112131&src-supplier=Verical; ComponentLink2URL: http://www.ti.com/lit/ds/symlink/lm1117-n.pdf?src-supplier=Avnet+Asia; ComponentLink2Description: http://www.ti.com/lit/ds/symlink/lm1117-n.pdf?src-supplier=Avnet+Asia; ComponentLink3URL: http://www.ti.com/lit/ds/symlink/lm1117.pdf?src-supplier=Digi-Key; ComponentLink3Description: http://www.ti.com/lit/ds/symlink/lm1117.pdf?src-supplier=Digi-Key; ComponentLink4URL: http://www.ti.com/lit/ds/symlink/lm1117-n.pdf?src-supplier=Avnet+Europe; ComponentLink4Description: http://www.ti.com/lit/ds/symlink/lm1117-n.pdf?src-supplier=Avnet+Europe; ComponentLink5URL: https://www.distrelec.com/ishop/Datasheets/lm1117_eng_tds.pdf?src-supplier=Distrelec; ComponentLink5Description: https://www.distrelec.com/ishop/Datasheets/lm1117_eng_tds.pdf?src-supplier=Distrelec
U?#2 = STM32F205RCT6: MCU 32-bit STM32 ARM Cortex M3 RISC 256KB Flash 2.5V/3.3V 64-Pin LQFP Tray; Manufacturer: STMicroelectronics; RAM Size: 100KB; Max Power Dissipation: 444mW; Interface: SDIO,I2C,SPI,USB,CAN,IrDA,MMC,UART,USART,LIN,I2S; Number of I/Os: 51; Number of Timers/Counters: 14; Max Supply Voltage: 3.6V; Number of PWM Channels: 2; Frequency: 120MHz; Min Supply Voltage: 1.8V; Number of Programmable I/O: 16; Data Bus Width: 32b; Oscillator Type: Internal; Number of SPI Channels: 3; Number of Ethernet Channels: 1; Watchdog Timer: Yes; Peripherals: Brown-out Detect/Reset,POR,PWM,WDT,DMA,LCD,I2C; Supplier 1: Digi-Key; Manufacturer Part Number: STM32F205RCT6; Stock 1: 1348; Pricing 1: 1=7.79, 10=7.04, 160=5.8288, 640=5.0756, 1120=4.4207 (USD); Case/Package: LQFP; Number of Pins: 64; Min Operating Temperature: -40°C; Max Operating Temperature: 85°C; Package Quantity: 160; Packaging: Tray; Max Frequency: 120MHz; Number of USB Channels: 2; Number of ADC Channels: 16; Number of I2C Channels: 3; Memory Type: FLASH; Memory Size: 256KB; Number of UART Channels: 2; Core Architecture: ARM; Length: 10.2mm; Height: 1.45mm; Width: 10.2mm; Radiation Hardening: No; REACH SVHC: No SVHC; Lead Free: Lead Free; ComponentLink1URL: http://www.farnell.com/datasheets/1776949.pdf?src-supplier=Element14; ComponentLink1Description: http://www.farnell.com/datasheets/1776949.pdf?src-supplier=Element14; ComponentLink2URL: http://www.st.com/web/en/resource/technical/document/datasheet/CD00237391.pdf?src-supplier=Future+Electronics; ComponentLink2Description: http://www.st.com/web/en/resource/technical/document/datasheet/CD00237391.pdf?src-supplier=Future+Electronics; ComponentLink3URL: http://www.st.com/web/en/resource/technical/document/datasheet/CD00237391.pdf?src-supplier=Avnet+Asia; ComponentLink3Description: http://www.st.com/web/en/resource/technical/document/datasheet/CD00237391.pdf?src-supplier=Avnet+Asia; ComponentLink4URL: http://www.produktinfo.conrad.com/datenblaetter/1000000-1099999/001075498-da-01-en-MCU_256KB_STM32F205RCT6_LQFP_64_STM.pdf?src-supplier=Conrad; ComponentLink4Description: http://www.produktinfo.conrad.com/datenblaetter/1000000-1099999/001075498-da-01-en-MCU_256KB_STM32F205RCT6_LQFP_64_STM.pdf?src-supplier=Conrad; Supplier Part Number 1: 497-11154-ND
X? = ABM3-25.000MHZ-D2Y-T: CRYSTAL 25.0000MHZ 18PF SMD; Manufacturer: Abracon; Frequency Tolerance: 20ppm; ESR (Equivalent Series Resistance): 30R; Frequency Stability: 30ppm; Supplier 1: Digi-Key; Manufacturer Part Number: ABM3-25.000MHZ-D2Y-T; Stock 1: 27285; Pricing 1: 1=0.73, 10=0.605, 50=0.5446, 100=0.484, 500=0.4598 (USD); Mount: Surface Mount; Case/Package: CSMD; Number of Pins: 2; Min Operating Temperature: -40°C; Max Operating Temperature: 85°C; Frequency: 25MHz; Load Capacitance: 18pF; Tolerance: 20ppm; Packaging: Tape and Reel; Package Quantity: 1000; Termination: SMD/SMT; Composition: Ceramic; Series Resistance: 30R; Length: 5mm; Height: 0.051inch; Width: 3.2mm; Depth: 3.2mm; REACH SVHC: Yes; Lead Free: Lead Free; ComponentLink1URL: http://www.abracon.com/Resonators/abm3.pdf?src-supplier=Future+Electronics; ComponentLink1Description: http://www.abracon.com/Resonators/abm3.pdf?src-supplier=Future+Electronics; ComponentLink2URL: https://abracon.com/Resonators/abm3.pdf?src-supplier=Digi-Key; ComponentLink2Description: https://abracon.com/Resonators/abm3.pdf?src-supplier=Digi-Key; ComponentLink3URL: http://www.farnell.com/datasheets/1754353.pdf?src-supplier=Element14; ComponentLink3Description: http://www.farnell.com/datasheets/1754353.pdf?src-supplier=Element14; Supplier Part Number 1: 535-10645-6-ND